# EAGLE schematic da7_schematic (EAGLE 9.3.2)
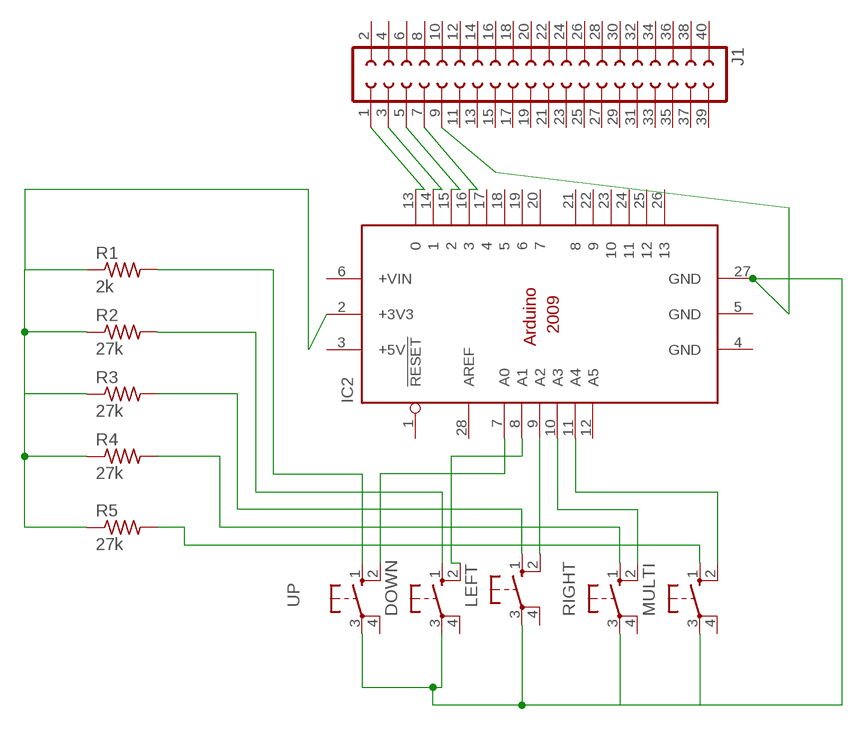
[diagram p0: schematic, sheet 1]

## Parts
DOWN  10-XX  [B3F-10XX]
IC2  ARDUINO2009_10  [ARDUINO2009]
J1  SOCKET-40V  [S40V]
LEFT  10-XX  [B3F-10XX]
MULTI  10-XX  [B3F-10XX]
R1  2k  R-US_0204/7  [0204/7]
R2  27k  R-US_0204/7  [0204/7]
R3  27k  R-US_0204/7  [0204/7]
R4  27k  R-US_0204/7  [0204/7]
R5  27k  R-US_0204/7  [0204/7]
RIGHT  10-XX  [B3F-10XX]
UP  10-XX  [B3F-10XX]

## Nets
N$1: IC2.13 J1.1
N$2: IC2.14 J1.3
N$3: IC2.15 J1.5
N$4: IC2.16 J1.7
N$5: IC2.27(GND) J1.9
N$6: R1.2 UP.1(S)
N$7: DOWN.1(S) R2.2
N$8: LEFT.1(S) R3.2
N$9: R4.2 RIGHT.1(S)
N$10: MULTI.1(S) R5.2
N$11: IC2.2(+3V3) R1.1 R2.1 R3.1 R4.1 R5.1
N$12: IC2.7(A0) UP.2(S1)
N$13: DOWN.2(S1) IC2.8(A1)
N$14: IC2.9(A2) LEFT.2(S1)
N$15: IC2.10(A3) RIGHT.2(S1)
N$16: IC2.11(A4) MULTI.2(S1)
N$17: DOWN.3(P) LEFT.3(P) MULTI.3(P) RIGHT.3(P) UP.3(P)
Unconnected: DOWN.4(P1) IC2.1(!RESET) IC2.6(+VIN) IC2.12(A5) IC2.17 IC2.18 IC2.19 IC2.20 IC2.21 IC2.22 IC2.23 IC2.24 IC2.25 IC2.26 IC2.28(AREF) J1.2 J1.4 J1.6 J1.8 J1.10 J1.11 J1.12 J1.13 J1.14 J1.15 J1.16 J1.17 J1.18 J1.19 J1.20 J1.21 J1.22 J1.23 J1.24 J1.25 J1.26 J1.27 J1.28 J1.29 J1.30 J1.31 J1.32 J1.33 J1.34 J1.35 J1.36 J1.37 J1.38 J1.39 J1.40 LEFT.4(P1) MULTI.4(P1) RIGHT.4(P1) UP.4(P1)

## Power pins joined to a net without a drawn wire
+5V: IC2.3(+5V)
GND: IC2.4(GND) IC2.5(GND)

## Library data of the parts
DOWN LEFT MULTI RIGHT UP = switch-omron:10-XX: OMRON SWITCH; MPN: B3F-1000; OC_FARNELL: 176432; OC_NEWARK: 36M3542
IC2 = arduino:ARDUINO2009_1: The Arduino Duemilanove ("2009") is a microcontroller board based on the ATmega168 or ATmega328. - 14 digital input/output pins (of which 6 can be used as PWM outputs) - 6 analog inputs, a 16 MHz crystal oscillator - USB connection - power jack - ISP header - reset button It contains everything needed to support the microcontroller; simply connect it to a computer with a USB cable or power it with a AC-to-DC adapter or battery to get started http://arduino.cc/en/Main/ArduinoBoardDuemilanove
J1 = con-3m-skt-header (1):SOCKET-40: 40 pin PCB Socket (3m 85xx/51xx)
R1-R5 = rcl:R-US_: RESISTOR, American symbol; SPICEPREFIX: R